# EAGLE design Sensor Board (EAGLE 7.7.0)
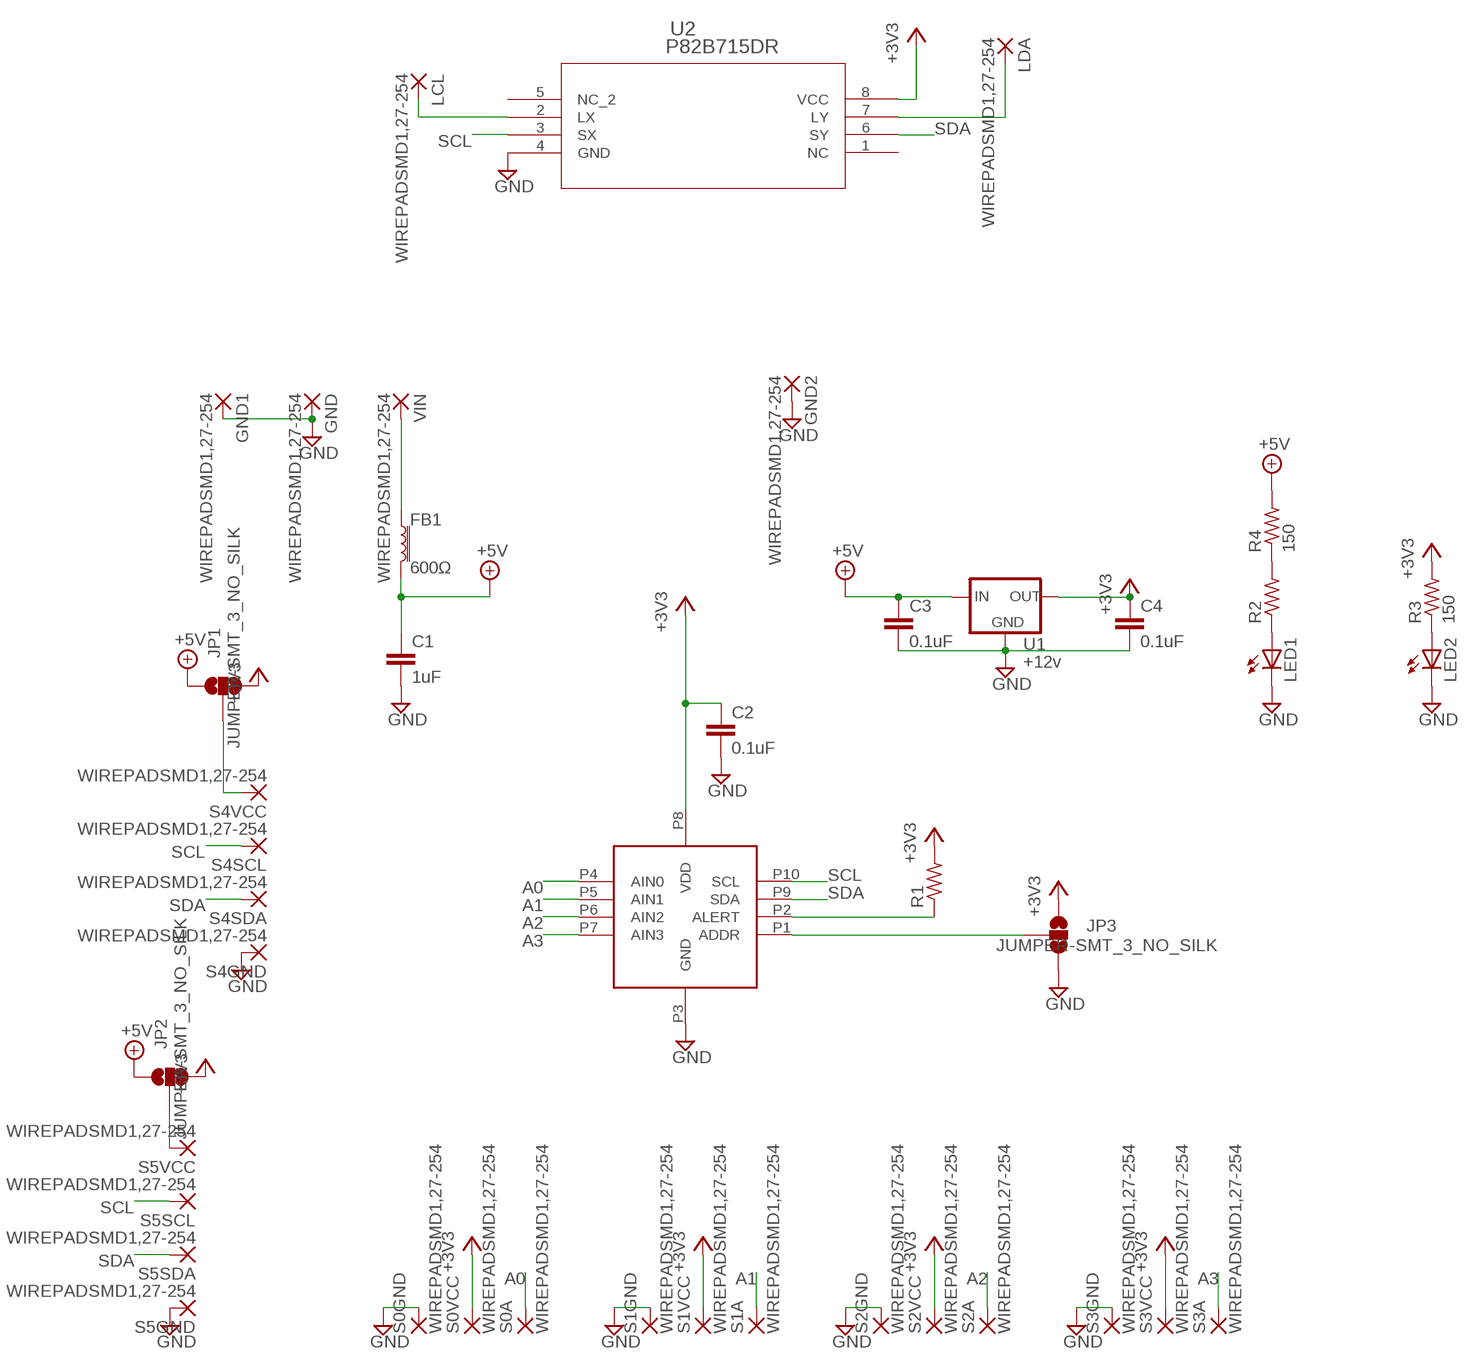
[diagram p0: schematic, sheet 1]

## Parts
C1  1uF  C-EUC0805  [C0805]
C2  0.1uF  C-EUC0805  [C0805]
C3  0.1uF  C-EUC0805  [C0805]
C4  0.1uF  C-EUC0805  [C0805]
FB1  600Ω  FERRITE_BEAD-0805-600Ω-100MHZ  [0805]
GND  WIREPADSMD1,27-254  [SMD1,27-2,54]
GND1  WIREPADSMD1,27-254  [SMD1,27-2,54]
GND2  WIREPADSMD1,27-254  [SMD1,27-2,54]
JP1  JUMPER-SMT_3_NO_SILK  [SMT-JUMPER_3_NO_SILK]
JP2  JUMPER-SMT_3_NO_SILK  [SMT-JUMPER_3_NO_SILK]
JP3  JUMPER-SMT_3_NO_SILK  [SMT-JUMPER_3_NO_SILK]
LCL  WIREPADSMD1,27-254  [SMD1,27-2,54]
LDA  WIREPADSMD1,27-254  [SMD1,27-2,54]
LED1  LEDCHIP-LED0805  [CHIP-LED0805]
LED2  LEDCHIP-LED0805  [CHIP-LED0805]
R1  R-US_R0805  [R0805]
R2  R-US_R0805  [R0805]
R3  150  R-US_R0805  [R0805]
R4  150  R-US_R0805  [R0805]
S0A  WIREPADSMD1,27-254  [SMD1,27-2,54]
S0GND  WIREPADSMD1,27-254  [SMD1,27-2,54]
S0VCC  WIREPADSMD1,27-254  [SMD1,27-2,54]
S1A  WIREPADSMD1,27-254  [SMD1,27-2,54]
S1GND  WIREPADSMD1,27-254  [SMD1,27-2,54]
S1VCC  WIREPADSMD1,27-254  [SMD1,27-2,54]
S2A  WIREPADSMD1,27-254  [SMD1,27-2,54]
S2GND  WIREPADSMD1,27-254  [SMD1,27-2,54]
S2VCC  WIREPADSMD1,27-254  [SMD1,27-2,54]
S3A  WIREPADSMD1,27-254  [SMD1,27-2,54]
S3GND  WIREPADSMD1,27-254  [SMD1,27-2,54]
S3VCC  WIREPADSMD1,27-254  [SMD1,27-2,54]
S4GND  WIREPADSMD1,27-254  [SMD1,27-2,54]
S4SCL  WIREPADSMD1,27-254  [SMD1,27-2,54]
S4SDA  WIREPADSMD1,27-254  [SMD1,27-2,54]
S4VCC  WIREPADSMD1,27-254  [SMD1,27-2,54]
S5GND  WIREPADSMD1,27-254  [SMD1,27-2,54]
S5SCL  WIREPADSMD1,27-254  [SMD1,27-2,54]
S5SDA  WIREPADSMD1,27-254  [SMD1,27-2,54]
S5VCC  WIREPADSMD1,27-254  [SMD1,27-2,54]
U1  +12v  V_REG_78XX7812  [TO-252]
U2  P82B715DR  [SO-08]
U3  ADS1115  [VSSOP-10]
VIN  WIREPADSMD1,27-254  [SMD1,27-2,54]

## Nets
+3V3: C2.1 C4.1 JP1.3 JP2.3 JP3.1 R1.2 R3.2 S0VCC.1(P) S1VCC.1(P) S2VCC.1(P) S3VCC.1(P) U1.2(OUT) U2.8(VCC) U3.P8(VDD)
+5V: C1.1 C3.1 FB1.2 JP1.1 JP2.1 R4.2 U1.1(IN)
A0: S0A.1(P) U3.P4(AIN0)
A1: S1A.1(P) U3.P5(AIN1)
A2: S2A.1(P) U3.P6(AIN2)
A3: S3A.1(P) U3.P7(AIN3)
GND: C1.2 C2.2 C3.2 C4.2 GND1.1(P) GND2.1(P) GND.1(P) JP3.3 LED1.C LED2.C S0GND.1(P) S1GND.1(P) S2GND.1(P) S3GND.1(P) S4GND.1(P) S5GND.1(P) U1.3(GND) U2.4(GND) U3.P3(GND)
N$1: R1.1 U3.P2(ALERT)
N$2: FB1.1 VIN.1(P)
N$3: JP2.2 S5VCC.1(P)
N$4: JP3.2 U3.P1(ADDR)
N$5: JP1.2 S4VCC.1(P)
N$6: LED1.A R2.1
N$7: LED2.A R3.1
N$8: R2.2 R4.1
N$9: LDA.1(P) U2.7(LY)
N$11: LCL.1(P) U2.2(LX)
SCL: S4SCL.1(P) S5SCL.1(P) U2.3(SX) U3.P10(SCL)
SDA: S4SDA.1(P) S5SDA.1(P) U2.6(SY) U3.P9(SDA)
Unconnected: U2.1(NC) U2.5(NC_2)

## Library data of the parts
C1-C4 = resistor:C-EU: CAPACITOR, European symbol
FB1 = SparkFun-Coils:FERRITE_BEAD: Ferrite Bead (blocks, cores, rings, chokes, etc.) Inductor with layers of ferrite used to suppress high frequencies. Often used to isolate high frequency noise. SparkFun Products: IOIO-OTG - V2.2 <https://www.sparkfun.com/products/13613> SparkFun SAMD21 Mini Breakout <https://www.sparkfun.com/products/13664> SparkFun 6 Degrees of Freedom Breakout - LSM6DS3 <https://www.sparkfun.com/products/13339> SparkFun SAMD21 Dev Breakout <https://www.sparkfun.com/products/13672> Lilypad MP3 <https://www.sparkfun.com/products/11013>; PROD_ID: NDUC-14988
GND GND1 GND2 LCL LDA S0A S0GND S0VCC S1A S1GND S1VCC S2A S2GND S2VCC S3A S3GND S3VCC S4GND S4SCL S4SDA S4VCC S5GND S5SCL S5SDA S5VCC VIN = wirepad:WIREPAD: Wire PAD connect wire on PCB
JP1-JP3 = SparkFun-Jumpers:JUMPER-SMT_3_NO: Normally open jumper This jumper has three pads in close proximity to each other. Apply solder to close the connection(s).
LED1 LED2 = led:LED: LED OSRAM: - CHIPLED LG R971, LG N971, LY N971, LG Q971, LY Q971, LO R971, LY R971 LH N974, LH R974 LS Q976, LO Q976, LY Q976 LO Q996 - Hyper CHIPLED LW Q18S LB Q993, LB Q99A, LB R99A - SideLED LS A670, LO A670, LY A670, LG A670, LP A670 LB A673, LV A673, LT A673, LW A673 LH A674 LY A675 LS A676, LA A676, LO A676, LY A676, LW A676 LS A679, LY A679, LG A679 - Hyper Micro SIDELED® LS Y876, LA Y876, LO Y876, LY Y876 LT Y87S - SmartLED LW L88C, LW L88S LB L89C, LB L89S, LG L890 LS L89K, LO L89K, LY L89K LS L896, LA L896, LO L896, LY L896 - TOPLED LS T670, LO T670, LY T670, LG T670, LP T670 LSG T670, LSP T670, LSY T670, LOP T670, LYG T670 LG T671, LOG T671, LSG T671 LB T673, LV T673, LT T673, LW T673 LH T674 LS T676, LA T676, LO T676, LY T676, LB T676, LH T676, LSB T676, LW T676 LB T67C, LV T67C, LT T67C, LS T67K, LO T67K, LY T67K, LW E67C LS E67B, LA E67B, LO E67B, LY E67B, LB E67C, LV E67C, LT E67C LW T67C LS T679, LY T679, LG T679 LS T770, LO T770, LY T770, LG T770, LP T770 LB T773, LV T773, LT T773, LW T773 LH T774 LS E675, LA E675, LY E675, LS T675 LS T776, LA T776, LO T776, LY T776, LB T776 LHGB T686 LT T68C, LB T68C - Hyper Mini TOPLED® LB M676 - Mini TOPLED Santana® LG M470 LS M47K, LO M47K, LY M47K Source: http://www.osram.convergy.de LUXEON: - LUMILED® LXK2-PW12-R00, LXK2-PW12-S00, LXK2-PW14-U00, LXK2-PW14-V00 LXK2-PM12-R00, LXK2-PM12-S00, LXK2-PM14-U00 LXK2-PE12-Q00, LXK2-PE12-R00, LXK2-PE12-S00, LXK2-PE14-T00, LXK2-PE14-U00 LXK2-PB12-K00, LXK2-PB12-L00, LXK2-PB12-M00, LXK2-PB14-N00, LXK2-PB14-P00, LXK2-PB14-Q00 LXK2-PR12-L00, LXK2-PR12-M00, LXK2-PR14-Q00, LXK2-PR14-R00 LXK2-PD12-Q00, LXK2-PD12-R00, LXK2-PD12-S00 LXK2-PH12-R00, LXK2-PH12-S00 LXK2-PL12-P00, LXK2-PL12-Q00, LXK2-PL12-R00 Source: www.luxeon.com KINGBRIGHT: KA-3528ASYC Source: www.kingbright.com
R1-R4 = resistor:R-US_: RESISTOR, American symbol
U1 = SparkFun-IC-Power:V_REG_78XX: Voltage Regulator Standard 78xx regulator. IGO (Input Ground Output). Spark Fun Electronics SKU : COM-00107; PROD_ID: VREG-12370
U2 = texas:P82B715DR
U3 = texas:ADS1115: 16-Bit 5-Channel I2C ADC

## Board
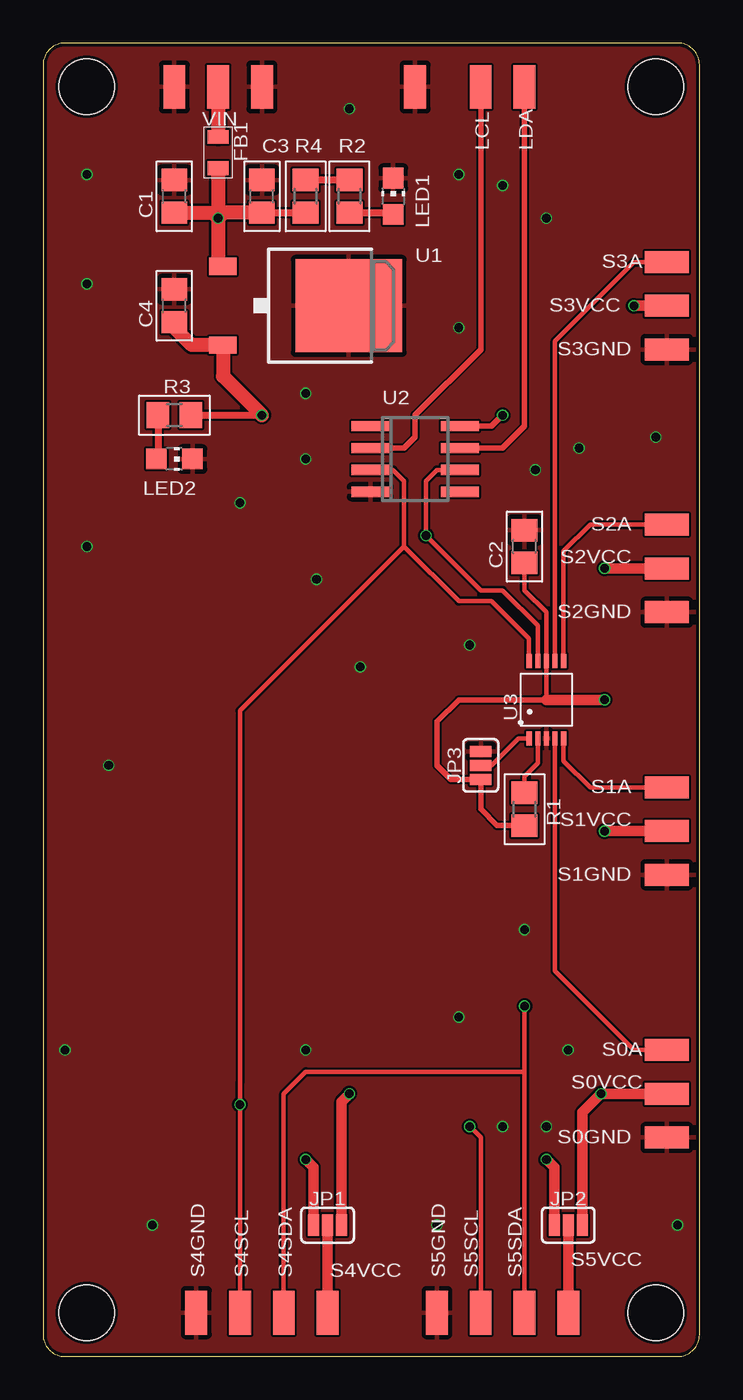
[diagram p1: board, top side]
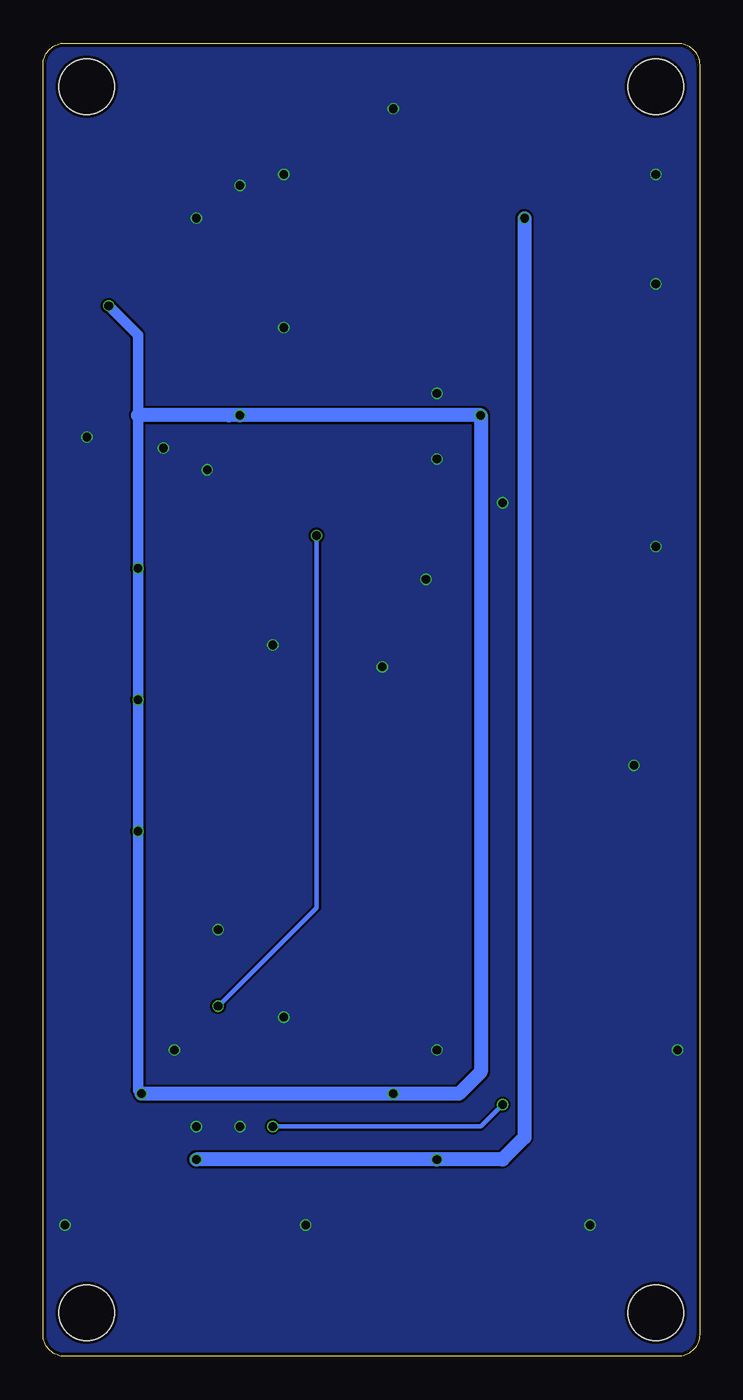
[diagram p2: board, bottom side, seen from below]

Size 38.1 x 76.2 mm. Coordinates in mm from the lower left corner, seen from the top.
Outline: 0,74.93 0,1.27 arc90 1.27,0 36.83,0 arc90 38.1,1.27 38.1,74.93 arc90 36.83,76.2 1.27,76.2 arc90 0,74.93
Copper layers (1*16): Top 0.035mm / dielectric 1.6mm / Bottom 0.035mm
Design rules "jlcpcb-2layers": minimum track width 5mil, minimum drill 0.3mm, track to track 5mil, track to pad 5mil, pad to pad 5mil, via to via 5mil, smd to smd 5mil, copper to edge 0.2mm, drill to drill 6mil, minimum pad ring 10mil, minimum via ring 3mil, stop-mask expansion 4mil, vias tented up to drill 0mil, thermal gap 10mil
Holes 3.2 mm at 35.56,2.54 35.56,73.66 2.54,2.54 2.54,73.66

### Footprints (pad centres in the part's own frame; a part is rotated, then mirrored left to right if it is on the bottom)
C0805 = smd 1.3 x 1.5: 1 -0.95,0; 2 0.95,0
0805 = smd 0.8 x 1.2: 1 -0.9,0; 2 0.9,0
SMD1,27-2,54 = smd 1.27 x 2.54: 1 0,0
SMT-JUMPER_3_NO_SILK = smd 0.635 x 1.27: 1 -0.813,0; 2 0,0; 3 0.813,0
CHIP-LED0805 = smd 1.2 x 1.2: A 0,-1.05; C 0,1.05
R0805 = smd 1.3 x 1.5: 1 -0.95,0; 2 0.95,0
TO-252 = smd 1 x 1.6: 1 -2.28,-4.8; 2 2.28,-4.8 | smd 5.4 x 6.2: 3 0,2.5
SO-08 = smd 0.6 x 2.2: 1 -1.905,-2.6; 2 -0.635,-2.6; 3 0.635,-2.6; 4 1.905,-2.6; 5 1.905,2.6; 6 0.635,2.6; 7 -0.635,2.6; 8 -1.905,2.6
VSSOP-10 = smd 0.8 x 0.3: P1 -2.25,1; P2 -2.25,0.5; P3 -2.25,0; P4 -2.25,-0.5; P5 -2.25,-1; P6 2.25,-1; P7 2.25,-0.5; P8 2.25,0; P9 2.25,0.5; P10 2.25,1

### Placement (x,y rotation side)
C1  7.62,67.31 90 top
C2  27.94,46.99 90 top
C3  12.7,67.31 90 top
C4  7.62,60.96 90 top
FB1  10.16,69.85 270 top
GND  7.62,73.66 180 top
GND1  12.7,73.66 0 top
GND2  21.59,73.66 0 top
JP1  16.51,7.62 0 top
JP2  30.48,7.62 0 top
JP3  25.4,34.29 90 top
LCL  25.4,73.66 0 top
LDA  27.94,73.66 0 top
LED1  20.32,67.31 0 top
LED2  7.62,52.07 270 top
R1  27.94,31.75 270 top
R2  17.78,67.31 90 top
R3  7.62,54.61 0 top
R4  15.24,67.31 270 top
S0A  36.2,17.78 90 top
S0GND  36.2,12.7 90 top
S0VCC  36.2,15.24 90 top
S1A  36.2,33.02 90 top
S1GND  36.2,27.94 90 top
S1VCC  36.2,30.48 90 top
S2A  36.2,48.26 90 top
S2GND  36.2,43.18 90 top
S2VCC  36.2,45.72 90 top
S3A  36.2,63.5 90 top
S3GND  36.2,58.42 90 top
S3VCC  36.2,60.96 90 top
S4GND  8.89,2.54 180 top
S4SCL  11.43,2.54 180 top
S4SDA  13.97,2.54 180 top
S4VCC  16.51,2.54 180 top
S5GND  22.86,2.54 0 top
S5SCL  25.4,2.54 0 top
S5SDA  27.94,2.54 0 top
S5VCC  30.48,2.54 0 top
U1  15.24,60.96 270 top
U2  21.59,52.07 270 top
U3  29.21,38.1 90 top
VIN  10.16,73.66 180 top

### Tracks (layer width: path | path; a pad name or v marks a point on that pad's centre or on a via)
+3V3  (via drill 0.5)
  Top 0.254: C2.1 27.94,44.45 29.21,43.18 U3.P8 29.21,38.1
  Top 0.305: R1.2 26.35,30.8 25.4,31.75 JP3.1 23.67,33.48 22.86,34.29 22.86,36.83 24.13,38.1 29.21,38.1 | U2.8 26.04,53.98 v26.67,54.61
  Top 0.406: R3.2 v12.7,54.61
  Top 0.61: S0VCC.1 v32.38,15.24 31.29,14.15 JP2.3 | v34.29,60.96 S3VCC.1 | S2VCC.1 v32.59,45.72 | S1VCC.1 v32.59,30.48 | JP1.3 17.32,14.78 v17.78,15.24 | 29.21,38.1 v32.59,38.1
  Top 0.813: C4.1 7.62,59.69 8.63,58.68 U1.2 10.44,56.87 v12.7,54.61
  Bottom 0.61: v34.29,60.96 32.59,59.26 32.59,54.61 v32.59,45.72 v32.59,38.1 v32.59,30.48 32.59,15.44 v32.38,15.24
  Bottom 0.813: 32.59,54.61 27.3,54.61 v26.67,54.61 v12.7,54.61 12.7,16.51 13.97,15.24 v17.78,15.24 v32.38,15.24
+5V  (via drill 0.5)
  Top 0.406: C3.1 R4.2
  Top 0.61: JP1.1 15.7,10.97 v15.24,11.43 | JP2.1 29.67,10.97 v29.21,11.43
  Top 0.813: FB1.2 v10.16,66.04 | v10.16,66.04 10.16,63.52 U1.1 | C1.1 9.84,66.36 v10.16,66.04 | C3.1 10.48,66.36 v10.16,66.04
  Bottom 0.813: v10.16,66.04 10.16,12.7 11.43,11.43 v15.24,11.43 v29.21,11.43
A0
  Top 0.254: U3.P4 29.71,22.36 34.29,17.78 S0A.1
A1
  Top 0.254: U3.P5 30.21,34.56 31.75,33.02 S1A.1
A2
  Top 0.254: U3.P6 30.21,46.72 31.75,48.26 S2A.1
A3
  Top 0.254: U3.P7 29.71,58.92 34.29,63.5 S3A.1
GND  (via drill 0.5)
  other vias: 17.78,72.39 2.54,68.58 2.54,62.23 24.13,59.69 29.21,66.04 24.13,68.58 35.56,53.34 15.24,52.07 31.11,52.7 2.54,46.99 3.81,34.29 1.27,17.78 6.35,7.62 22.86,7.62 36.83,7.62 30.48,17.78 15.24,17.78 29.21,13.34 24.77,41.27 11.43,49.53 26.67,13.34 24.13,19.68 27.94,24.77 18.41,40.01 15.88,45.09 28.57,51.44 26.67,67.94 15.24,55.88
  pour Bottom: -2.54,78.74 40.64,78.74 40.64,-2.54 -2.54,-2.54
  pour Top: -1.27,77.47 39.37,77.47 39.37,-1.27 -1.27,-1.27
N$1
  Top 0.254: U3.P2 28.71,34.42 27.94,33.66 R1.1
N$2
  Top 0.813: VIN.1 FB1.1
N$3
  Top 0.61: JP2.2 S5VCC.1
N$4
  Top 0.254: U3.P1 27.59,35.85 26.04,34.29 JP3.2
N$5
  Top 0.61: JP1.2 S4VCC.1
N$6
  Top 0.406: R2.1 20.22,66.36 LED1.A
N$7
  Top 0.406: R3.1 6.67,52.17 LED2.A
N$8
  Top 0.406: R4.1 R2.2
N$9
  Top 0.305: U2.7 26.67,52.7 27.94,53.98 LDA.1
N$11
  Top 0.305: U2.2 20.95,52.7 21.59,53.34 21.59,54.61 25.4,58.42 LCL.1
SCL  (via drill 0.5)
  Top 0.254: U3.P10 28.21,41.64 26.04,43.81 24.13,43.81 20.95,46.99 | 20.95,46.99 20.95,50.8 20.32,51.44 U2.3 | 20.95,46.99 11.43,37.47 11.43,15.88 v11.43,14.61 S4SCL.1 | S5SCL.1 25.4,12.7 v24.77,13.34
  Bottom 0.254: v24.77,13.34 12.7,13.34 v11.43,14.61
SDA  (via drill 0.5)
  Top 0.254: U3.P9 28.71,42.41 26.67,44.45 25.4,44.45 v22.23,47.62 22.23,50.8 22.86,51.44 U2.6 | v27.94,20.32 27.94,16.51 | 27.94,16.51 S5SDA.1 | S4SDA.1 13.97,15.24 15.24,16.51 27.94,16.51
  Bottom 0.254: v22.23,47.62 22.23,26.04 v27.94,20.32